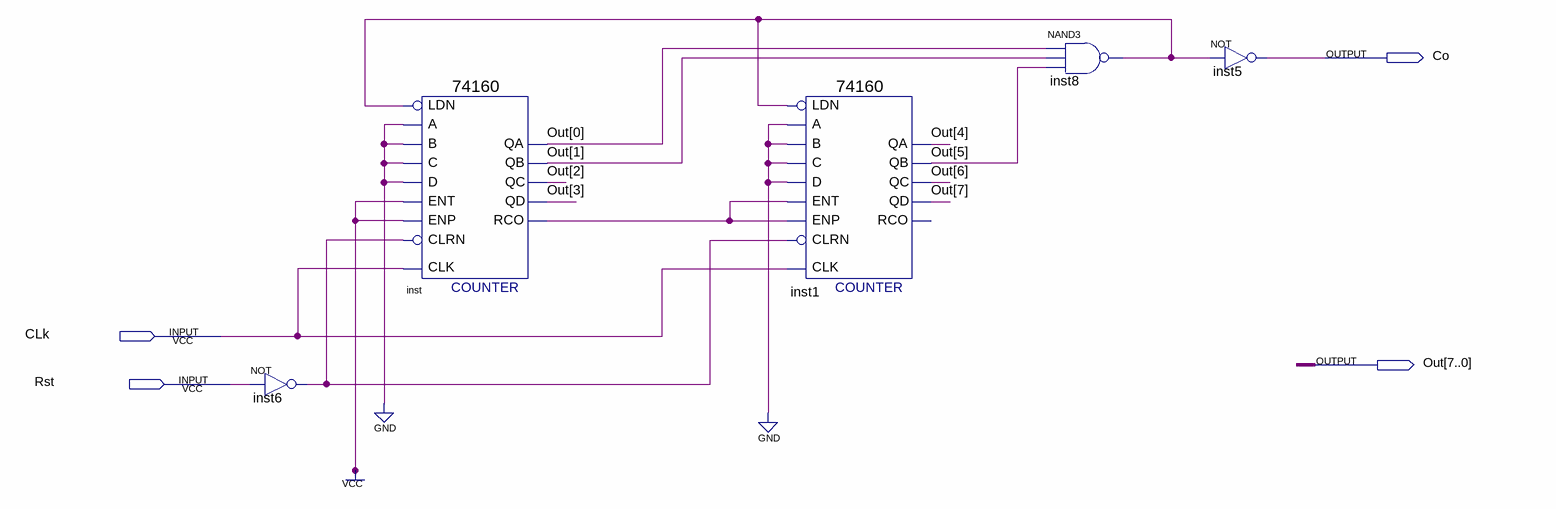
[diagram p0: schematic sheet]
// Quartus schematic Cnt_24.bdf as structural Verilog: 5 symbols, 4 pins
module Cnt_24 (
  input  CLk,
  input  Rst,
  output Co,
  output [7:0] Out
);

  wire inst6_out, inst8_out, inst_rco;

  not inst6 (inst6_out, Rst);
  \74160  inst (
    .CLK(CLk), .ENT(1'b1), .A(1'b0), .B(1'b0), .C(1'b0), .D(1'b0), .LDN(inst8_out), .ENP(1'b1),
    .CLRN(inst6_out), .QD(Out[3]), .QA(Out[0]), .QB(Out[1]), .QC(Out[2]), .RCO(inst_rco));
  \74160  inst1 (
    .CLK(CLk), .ENT(inst_rco), .A(1'b0), .B(1'b0), .C(1'b0), .D(1'b0), .LDN(inst8_out), .ENP(inst_rco),
    .CLRN(inst6_out), .QD(Out[7]), .QA(Out[4]), .QB(Out[5]), .QC(Out[6]));  // open: RCO
  nand inst8 (inst8_out, Out[0], Out[1], Out[5]);
  not inst5 (Co, inst8_out);
endmodule
